# EAGLE schematic PCB_ANILLO (EAGLE 9.6.2)
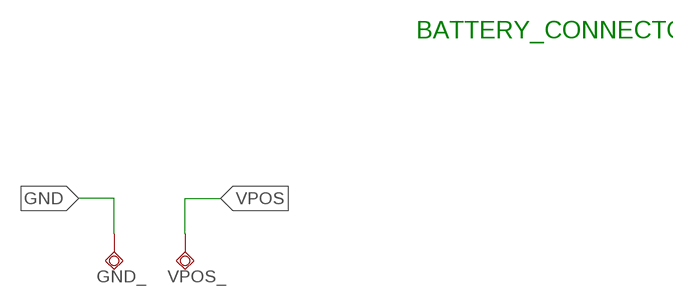
[diagram p0: schematic, sheet 1]

## Parts
GND_  TESTPAD_TPSQB1,27  [TESTPAD_B1,27]
VPOS_  TESTPAD_TPSQB1,27  [TESTPAD_B1,27]

## Nets
GND: GND_.TP
VPOS: VPOS_.TP

## Notes on the sheet
- BATTERY_CONNECTOR

## Library data of the parts
GND_ VPOS_ = BeagleBone_Blue_R3:TESTPAD_TPSQ: Test pad